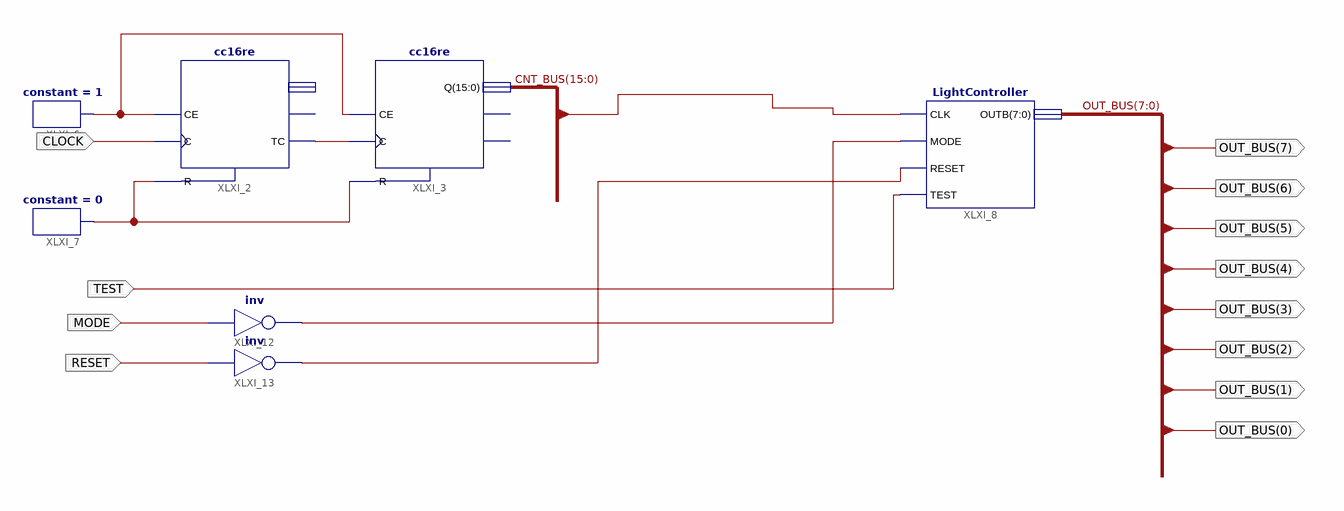
[diagram p0: schematic sheet 1]
// Xilinx ISE schematic TopLevel.sch (spartan3a) as structural Verilog: 7 symbols, 12 ports
module TopLevel (
  input  CLOCK,
  input  MODE,
  input  RESET,
  input  TEST,
  output [7:0] OUT_BUS
);

  wire XLXN_1, XLXN_5, XLXN_12, XLXN_48, XLXN_49;
  wire [15:0] CNT_BUS;

  cc16re XLXI_2 (.C(CLOCK), .CE(XLXN_12), .R(XLXN_5), .TC(XLXN_1));  // open: CEO, Q
  cc16re XLXI_3 (.C(XLXN_1), .CE(XLXN_12), .R(XLXN_5), .Q(CNT_BUS));  // open: CEO, TC
  constant #(.CValue("1")) XLXI_6 (.O(XLXN_12));
  constant #(.CValue("0")) XLXI_7 (.O(XLXN_5));
  LightController XLXI_8 (.CLK(CNT_BUS[4]), .RESET(XLXN_49), .MODE(XLXN_48), .OUTB(OUT_BUS), .TEST(TEST));
  not XLXI_12 (XLXN_48, MODE);
  not XLXI_13 (XLXN_49, RESET);
endmodule
